# Altium schematic sheet Board Connectors.SchDoc: Board Connectors
size B; Organization: Drexel University; Address1: ECE Senior Design; Address2: 2018-2019; Address3: ECE-08; Revision: 1.0; SheetNumber: 2; SheetTotal: 9; ProjectName: Rock960 Cape
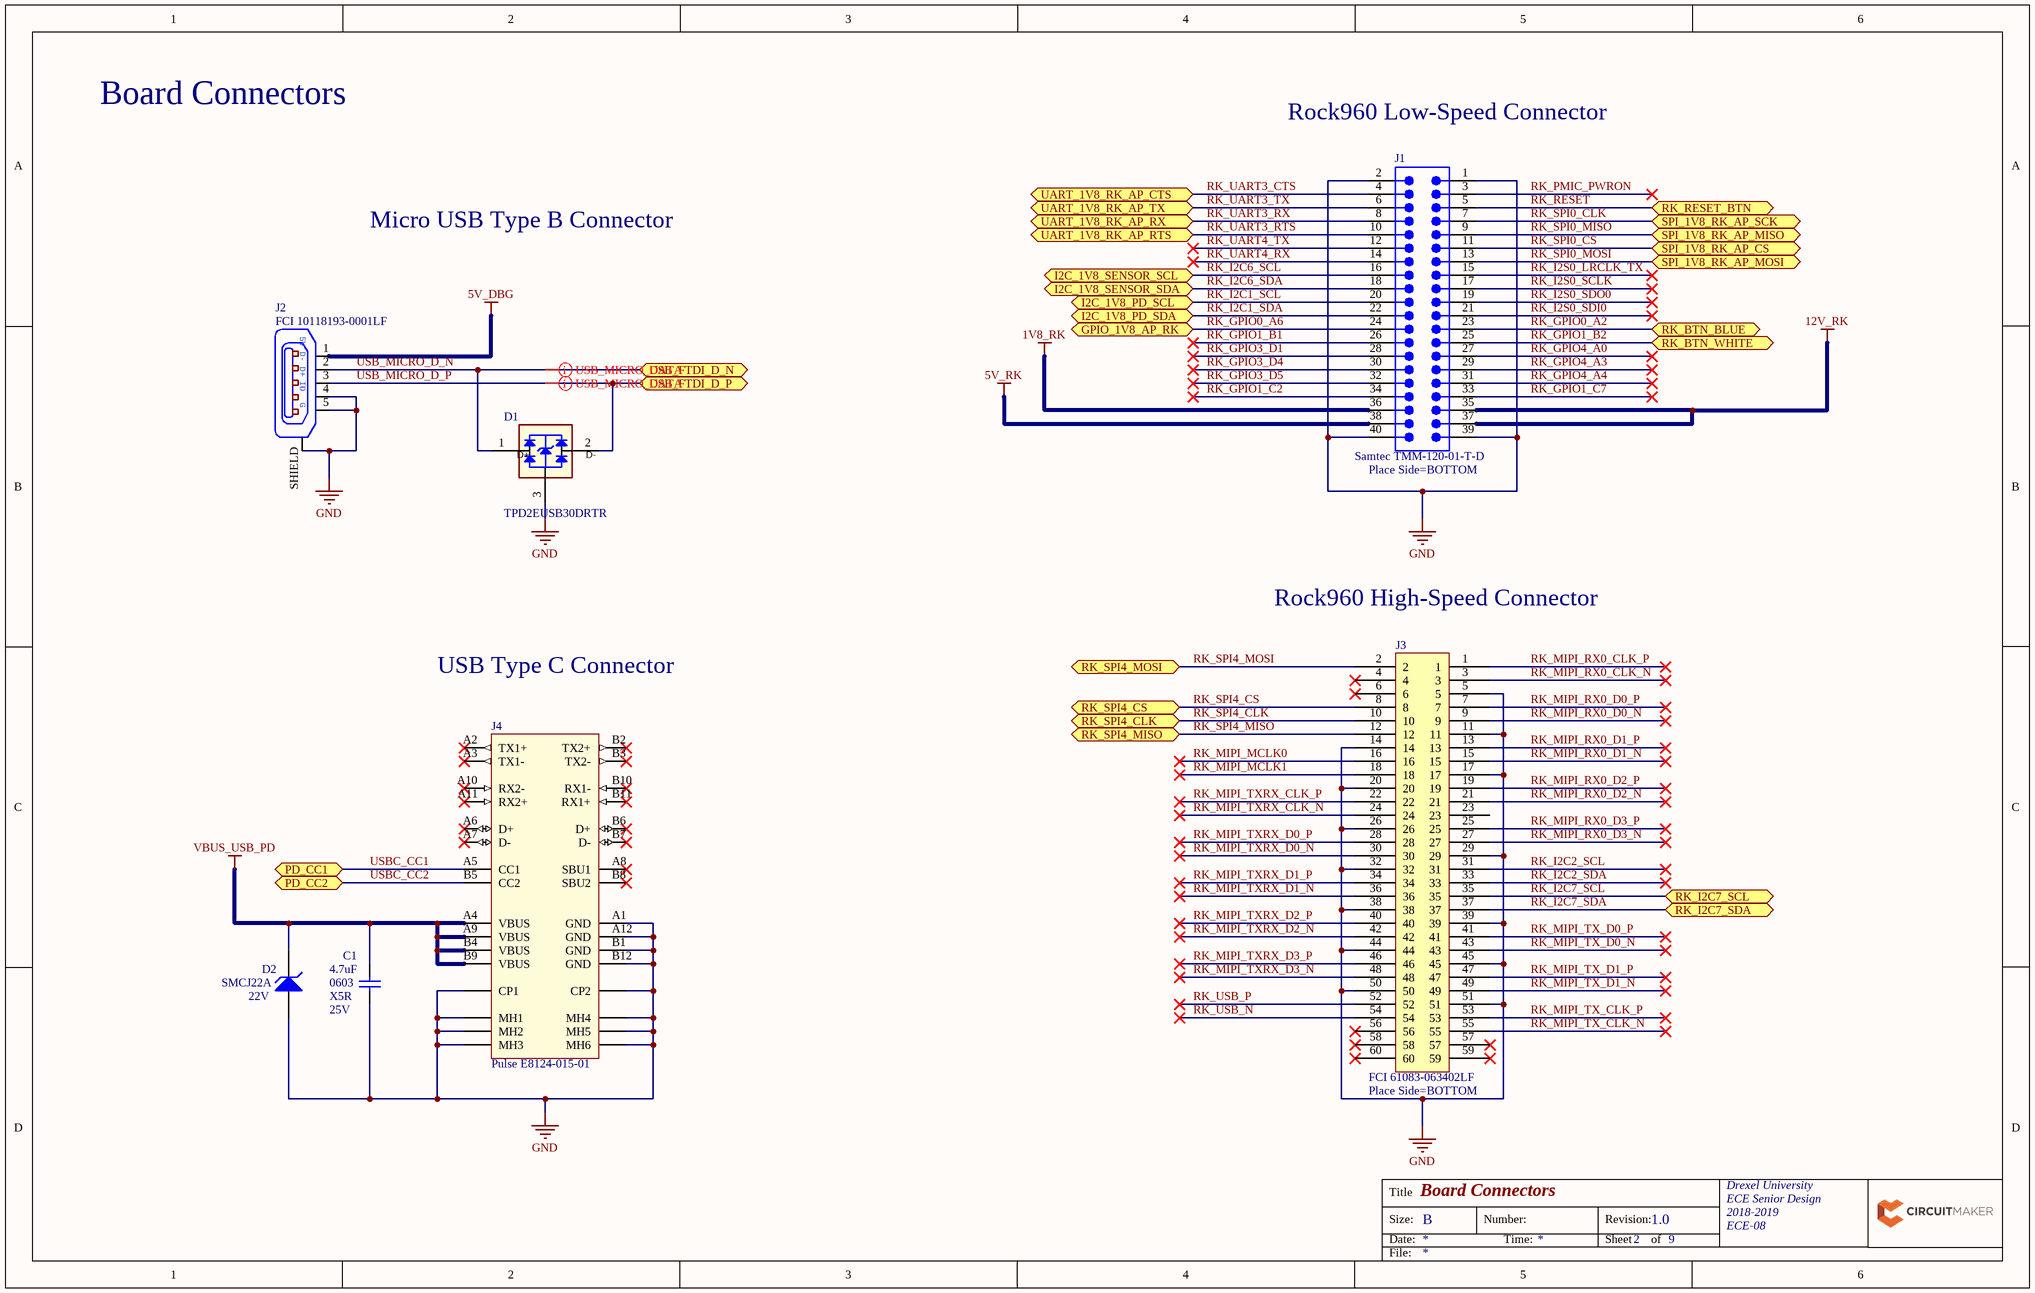
[diagram p0: Board Connectors.SchDoc]

## Parts
C1  Capacitance: 4.7uF  Case/Package: 0603  Dielectric Characteristic: X5R  Voltage Rating (DC): 25V  [CAPC1608X90X35ML10T15]  (hidden comment: Murata GRM188R61E475KE11D)
D1  TPD2EUSB30DRTR  [T_TI_TPD2EUSB30DRTR]
D2  SMCJ22A  Reverse Voltage: 22V  [PCB-gk7qhtajnaxh6qo3xtq4-1]
J1  Samtec TMM-120-01-T-D  [TMM-120-01-T-D]
J2  FCI 10118193-0001LF  [MICRO-USB5+6P-SMD-0.65-B]
J3  FCI 61083-063402LF  [PCB-7ti9pzjasutfjj4nekyo-1]
J4  Pulse E8124-015-01  [PCB-zoek8xqsb2swisfr99my-1]

## Ports
GPIO_1V8_AP_RK, I2C_1V8_PD_SCL (bidir), I2C_1V8_PD_SDA (bidir), I2C_1V8_SENSOR_SCL, I2C_1V8_SENSOR_SDA, PD_CC1 (bidir), PD_CC2 (bidir), RK_BTN_BLUE, RK_BTN_WHITE, RK_I2C7_SCL (bidir), RK_I2C7_SDA (bidir), RK_RESET_BTN, RK_SPI4_CLK (bidir), RK_SPI4_CS (bidir), RK_SPI4_MISO (bidir), RK_SPI4_MOSI (bidir), SPI_1V8_RK_AP_CS, SPI_1V8_RK_AP_MISO, SPI_1V8_RK_AP_MOSI, SPI_1V8_RK_AP_SCK, UART_1V8_RK_AP_CTS, UART_1V8_RK_AP_RTS, UART_1V8_RK_AP_RX, UART_1V8_RK_AP_TX, USB_FTDI_D_N, USB_FTDI_D_P

## Nets
1V8_RK: J1.36
5V_DBG: J2.1
5V_RK: J1.38
12V_RK: J1.35 J1.37
GND: C1.1 D1.3(GND) D2.1(A) J1.1 J1.2 J1.39 J1.40 J2.4 J2.5 J2.SHIELD J3.5 J3.11 J3.14 J3.17 J3.20 J3.26 J3.29 J3.32 J3.38 J3.39 J3.44 J3.45 J3.50 J3.51 J4.A1(GND) J4.A12(GND) J4.B1(GND) J4.B12(GND) J4.CP1 J4.CP2 J4.MH1 J4.MH2 J4.MH3 J4.MH4 J4.MH5 J4.MH6
VBUS_USB_PD: C1.2 D2.2(K) J4.A4(VBUS) J4.A9(VBUS) J4.B4(VBUS) J4.B9(VBUS)
RK_GPIO0_A2: J1.23 ; port RK_BTN_BLUE
RK_GPIO0_A6: J1.24 ; port GPIO_1V8_AP_RK
RK_GPIO1_B1: J1.26
RK_GPIO1_B2: J1.25 ; port RK_BTN_WHITE
RK_GPIO1_C2: J1.34
RK_GPIO1_C7: J1.33
RK_GPIO3_D1: J1.28
RK_GPIO3_D4: J1.30
RK_GPIO3_D5: J1.32
RK_GPIO4_A0: J1.27
RK_GPIO4_A3: J1.29
RK_GPIO4_A4: J1.31
RK_I2C1_SCL: J1.20 ; port I2C_1V8_PD_SCL
RK_I2C1_SDA: J1.22 ; port I2C_1V8_PD_SDA
RK_I2C2_SCL: J3.31
RK_I2C2_SDA: J3.33
RK_I2C6_SCL: J1.16 ; port I2C_1V8_SENSOR_SCL
RK_I2C6_SDA: J1.18 ; port I2C_1V8_SENSOR_SDA
RK_I2C7_SCL: J3.35 ; port RK_I2C7_SCL
RK_I2C7_SDA: J3.37 ; port RK_I2C7_SDA
RK_I2S0_LRCLK_TX: J1.15
RK_I2S0_SCLK: J1.17
RK_I2S0_SDI0: J1.21
RK_I2S0_SDO0: J1.19
RK_MIPI_MCLK0: J3.16
RK_MIPI_MCLK1: J3.18
RK_MIPI_RX0_CLK_N: J3.3
RK_MIPI_RX0_CLK_P: J3.1
RK_MIPI_RX0_D0_N: J3.9
RK_MIPI_RX0_D0_P: J3.7
RK_MIPI_RX0_D1_N: J3.15
RK_MIPI_RX0_D1_P: J3.13
RK_MIPI_RX0_D2_N: J3.21
RK_MIPI_RX0_D2_P: J3.19
RK_MIPI_RX0_D3_N: J3.27
RK_MIPI_RX0_D3_P: J3.25
RK_MIPI_TX_CLK_N: J3.55
RK_MIPI_TX_CLK_P: J3.53
RK_MIPI_TX_D0_N: J3.43
RK_MIPI_TX_D0_P: J3.41
RK_MIPI_TX_D1_N: J3.49
RK_MIPI_TX_D1_P: J3.47
RK_MIPI_TXRX_CLK_N: J3.24
RK_MIPI_TXRX_CLK_P: J3.22
RK_MIPI_TXRX_D0_N: J3.30
RK_MIPI_TXRX_D0_P: J3.28
RK_MIPI_TXRX_D1_N: J3.36
RK_MIPI_TXRX_D1_P: J3.34
RK_MIPI_TXRX_D2_N: J3.42
RK_MIPI_TXRX_D2_P: J3.40
RK_MIPI_TXRX_D3_N: J3.48
RK_MIPI_TXRX_D3_P: J3.46
RK_PMIC_PWRON: J1.3
RK_RESET: J1.5 ; port RK_RESET_BTN
RK_SPI0_CLK: J1.7 ; port SPI_1V8_RK_AP_SCK
RK_SPI0_CS: J1.11 ; port SPI_1V8_RK_AP_CS
RK_SPI0_MISO: J1.9 ; port SPI_1V8_RK_AP_MISO
RK_SPI0_MOSI: J1.13 ; port SPI_1V8_RK_AP_MOSI
RK_SPI4_CLK: J3.10 ; port RK_SPI4_CLK
RK_SPI4_CS: J3.8 ; port RK_SPI4_CS
RK_SPI4_MISO: J3.12 ; port RK_SPI4_MISO
RK_SPI4_MOSI: J3.2 ; port RK_SPI4_MOSI
RK_UART3_CTS: J1.4 ; port UART_1V8_RK_AP_CTS
RK_UART3_RTS: J1.10 ; port UART_1V8_RK_AP_RTS
RK_UART3_RX: J1.8 ; port UART_1V8_RK_AP_RX
RK_UART3_TX: J1.6 ; port UART_1V8_RK_AP_TX
RK_UART4_RX: J1.14
RK_UART4_TX: J1.12
RK_USB_N: J3.54
RK_USB_P: J3.52
USB_MICRO_D_N: D1.1(D+) J2.2 ; port USB_FTDI_D_N
USB_MICRO_D_P: D1.2(D-) J2.3 ; port USB_FTDI_D_P
USBC_CC1: J4.A5(CC1) ; port PD_CC1
USBC_CC2: J4.B5(CC2) ; port PD_CC2

Not connected (* = marked no-connect by the designer): J3 4* 6* 23 56* 57* 58* 59* 60*; J4 A2(TX1+)* A3(TX1-)* A6(D+)* A7(D-)* A8(SBU1)* A10(RX2-)* A11(RX2+)* B2(TX2+)* B3(TX2-)* B6(D+)* B7(D-)* B8(SBU2)* B10(RX1-)* B11(RX1+)*

## Layout directives
differential pair: USB_MICRO_D_N, USB_MICRO_D_P

## Notes on the sheet
- Board Connectors
- Rock960 Low-Speed Connector
- Micro USB Type B Connector
- (near J1) Place Side=BOTTOM
- Rock960 High-Speed Connector
- USB Type C Connector
- (near J3) Place Side=BOTTOM
- Title
- Size:
- Date:
- B
- Number:
- Time:
- Revision:
- Sheet
- of
- File:
- (in symbol CMP-b7d77f99eeaa6810-17) 5V; D-; D+; ID; G

## Library data of the parts
C1 = CMP-8856396-4: CAP CER 4.7UF 25V 10% X5R 0603; Capacitance Tolerance: ±10%; Lifecycle Status: Active; Octopart Url: https://octopart.com/grm188r61e475ke11d-murata-26982327; OctopartID: 0176c9e793a7deb1; Packaging: Cut Tape (CT); REACH SVHC Compliance: No SVHC; RoHS: Compliant; Size-Length: 0.0016 m; Size-Thickness: 0.0008 m; Size-Width: 0.0008 m; Manufacturer Part Number: GRM188R61E475KE11D
D1 = CMP-19307392-6: 2-Channel ESD Solution for SuperSpeed USB 3.0 Interface 3-SOT -40 to 85; Manufacturer Name: Texas Instruments; Lead-Free Status: Lead Free; Number of Channels: 2; Operating Voltage: 5.5V; Clamp Voltage: 8.0V; Capacitance: 700 fF; Manufacturer Part No.: TPD2EUSB30DRTR; Number of Pins: 3; RoHS: Compliant; Packaging: Tape & Reel (TR), Cut Tape (CT); Lifecycle Status: Active; Manufacturer Part Number: TPD2EUSB30DRTR; Octopart URL: http://octopart.com/tpd2eusb30drtr-texas+instruments-18093488; REACH SVHC Compliance: No SVHC; OctopartID: 42478a5972919d80
D2 = CMP-9cf25530e9434335-1: SMCJ Series 35.5 V 1.5 kW Surface Mount Uni-Directional TVS Diode - DO-214AB
J1 = CMP-43228a2c51039ce5-1: Conn Unshrouded Header HDR 40 POS 2mm Solder ST Thru-Hole; Gender: Male; Lead-Free Status: Lead Free; Number of Contacts: 40; Pin Pitch: 2.00 mm; Octopart URL: https://octopart.com/tmm-120-01-t-d-samtec-276295; Manufacturer Part Number: TMM-120-01-T-D; Color: Black; Contact Material: Phosphor Bronze; Contact Plating: Tin; Housing Color: Black; Housing Material: Plastic; Mounting Style: Through Hole, Vertical; Number of Positions: 40; Number of Rows: 2; Operating Temperature: 105 °C (max); Packaging: Tube; REACH SVHC Compliance: No SVHC; RoHS: Compliant; Size-Height: 1.50 mm; Size-Length: 40.0 mm; Size-Width: 3.94 mm; OctopartID: 43228a2c51039ce5
J2 = CMP-b7d77f99eeaa6810-17: Conn Micro USB Type B RCP 5 POS 0.65mm Solder RA SMD 5 Terminal 1 Port T/R
J3 = CMP-fca037f0475d2367-2: Bergstak® : 60 Positions; Dual Row; BTBVertical Header tape & Reel; Gender: Male; Pin Pitch: 800 µm; Contact Resistance: 50.0 mΩ (max); Number of Contacts: 60; Flammability Rating: UL 94 V-0; Orientation: Vertical; Contact Plating: Gold; Size-Height: 6.70 mm; RoHS: Compliant; Mounting Style: Surface Mount, Vertical; Size-Length: 29.8 mm; Number of Rows: 2; Contact Material: Brass; OctopartID: fca037f0475d2367
J4 = CMP-5cde91da6a388319-4: Conn USB Type C RCP 24 POS 0.5mm Solder RA SMD 24 Terminal 1 Port